# EAGLE schematic taco (EAGLE 7.4.0)
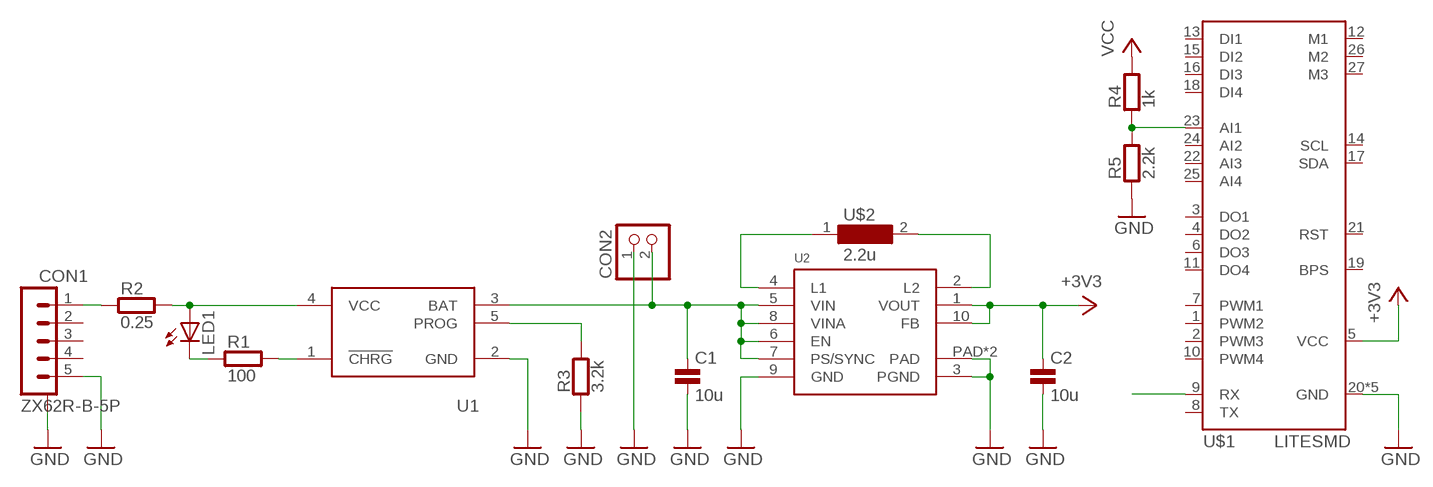
[diagram p0: schematic, sheet 1]

## Parts
C1  10u  C0603  [0603]
C2  10u  C0603  [0603]
CON1  ZX62R-B-5P  [MICRO-B]
CON2  JST-PH2  [JST-PH2]
LED1  LEDSML0603  [SML0603]
R1  100  R0603  [0603]
R2  0.25  R0603  [0603]
R3  3.2k  R0603  [0603]
R4  1k  R0603  [0603]
R5  2.2k  R0603  [0603]
U1  LTC4054  [TSOT23-5]
U2  TPS6300XDRCT  [S-PVSON-N10]
U$1  LITESMD  [LITE]
U$2  2.2u  VLF4012ST  [VLF4012ST]

## Nets
+3V3: C2.1 U2.1(VOUT) U2.10(FB) U$1.5(VCC)
GND: C1.2 C2.2 CON1.5(1.VBUS) CON1.CASE@1 CON1.CASE@2 CON1.CASE@3 CON1.CASE@4 CON2.1 R3.1 R5.1 U1.2(GND) U2.3(PGND) U2.9(GND) U2.PAD U2.PAD@1(PAD) U$1.20(GND) U$1.28(GND) U$1.30(GND) U$1.31(GND) U$1.32(GND)
N$1: LED1.A R2.2 U1.4(VCC)
N$2: R1.2 U1.1(!CHRG!)
N$3: LED1.C R1.1
N$4: U2.4(L1) U$2.1
N$5: U2.2(L2) U$2.2
N$6: R4.1 R5.2 U$1.23(AI1)
N$7: CON1.1(5.GND) R2.1
N$9: R3.2 U1.5(PROG)
U3: U$1.9(RX)
VCC: C1.1 CON2.2 R4.2 U1.3(BAT) U2.5(VIN) U2.6(EN) U2.7(PS/SYNC) U2.8(VINA)
Unconnected: CON1.2(4.ID) CON1.3(3.D+) CON1.4(2.D-) U$1.1(PWM2) U$1.2(PWM3) U$1.3(DO1) U$1.4(DO2) U$1.6(DO3) U$1.7(PWM1) U$1.8(TX) U$1.10(PWM4) U$1.11(DO4) U$1.12(M1) U$1.13(DI1) U$1.14(SCL) U$1.15(DI2) U$1.16(DI3) U$1.17(SDA) U$1.18(DI4) U$1.19(BPS) U$1.21(RST) U$1.22(AI3) U$1.24(AI2) U$1.25(AI4) U$1.26(M2) U$1.27(M3)

## Library data of the parts
C1 C2 = untitled:C: CAPACITOR
CON1 = untitled:ZX62R-B-5P
CON2 = untitled:JST-PH2
LED1 = led:LED: LED OSRAM: - CHIPLED LG R971, LG N971, LY N971, LG Q971, LY Q971, LO R971, LY R971 LH N974, LH R974 LS Q976, LO Q976, LY Q976 LO Q996 - Hyper CHIPLED LW Q18S LB Q993, LB Q99A, LB R99A - SideLED LS A670, LO A670, LY A670, LG A670, LP A670 LB A673, LV A673, LT A673, LW A673 LH A674 LY A675 LS A676, LA A676, LO A676, LY A676, LW A676 LS A679, LY A679, LG A679 - Hyper Micro SIDELED® LS Y876, LA Y876, LO Y876, LY Y876 LT Y87S - SmartLED LW L88C, LW L88S LB L89C, LB L89S, LG L890 LS L89K, LO L89K, LY L89K LS L896, LA L896, LO L896, LY L896 - TOPLED LS T670, LO T670, LY T670, LG T670, LP T670 LSG T670, LSP T670, LSY T670, LOP T670, LYG T670 LG T671, LOG T671, LSG T671 LB T673, LV T673, LT T673, LW T673 LH T674 LS T676, LA T676, LO T676, LY T676, LB T676, LH T676, LSB T676, LW T676 LB T67C, LV T67C, LT T67C, LS T67K, LO T67K, LY T67K, LW E67C LS E67B, LA E67B, LO E67B, LY E67B, LB E67C, LV E67C, LT E67C LW T67C LS T679, LY T679, LG T679 LS T770, LO T770, LY T770, LG T770, LP T770 LB T773, LV T773, LT T773, LW T773 LH T774 LS E675, LA E675, LY E675, LS T675 LS T776, LA T776, LO T776, LY T776, LB T776 LHGB T686 LT T68C, LB T68C - Hyper Mini TOPLED® LB M676 - Mini TOPLED Santana® LG M470 LS M47K, LO M47K, LY M47K Source: http://www.osram.convergy.de LUXEON: - LUMILED® LXK2-PW12-R00, LXK2-PW12-S00, LXK2-PW14-U00, LXK2-PW14-V00 LXK2-PM12-R00, LXK2-PM12-S00, LXK2-PM14-U00 LXK2-PE12-Q00, LXK2-PE12-R00, LXK2-PE12-S00, LXK2-PE14-T00, LXK2-PE14-U00 LXK2-PB12-K00, LXK2-PB12-L00, LXK2-PB12-M00, LXK2-PB14-N00, LXK2-PB14-P00, LXK2-PB14-Q00 LXK2-PR12-L00, LXK2-PR12-M00, LXK2-PR14-Q00, LXK2-PR14-R00 LXK2-PD12-Q00, LXK2-PD12-R00, LXK2-PD12-S00 LXK2-PH12-R00, LXK2-PH12-S00 LXK2-PL12-P00, LXK2-PL12-Q00, LXK2-PL12-R00 Source: www.luxeon.com KINGBRIGHT: KA-3528ASYC Source: www.kingbright.com
R1-R5 = untitled:R: RESISTOR
U1 = untitled:LTC4054
U2 = untitled:TPS6300XDRCT
U$1 = untitled:LITE
U$2 = untitled:VLF4012ST